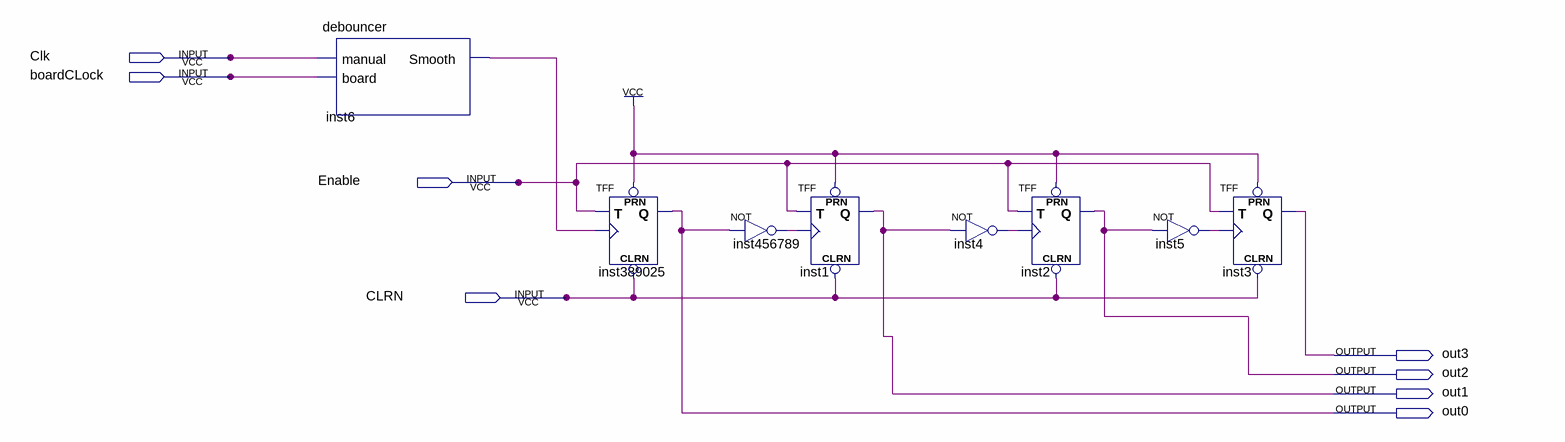
[diagram p0: schematic sheet]
// Quartus schematic upcounter.bdf as structural Verilog: 8 symbols, 8 pins
module upcounter (
  input  Clk,
  input  boardCLock,
  input  Enable,
  input  CLRN,
  output out3,
  output out2,
  output out1,
  output out0
);

  wire inst4_out, inst5_out, inst6_smooth, inst456789_out;

  debouncer inst6 (.manual(Clk), .board(boardCLock), .Smooth(inst6_smooth));
  TFF inst389025 (.PRN(1'b1), .CLRN(CLRN), .T(Enable), .CLK(inst6_smooth), .Q(out0));
  TFF inst1 (.PRN(1'b1), .CLRN(CLRN), .T(Enable), .CLK(inst456789_out), .Q(out1));
  not inst456789 (inst456789_out, out0);
  not inst4 (inst4_out, out1);
  TFF inst2 (.PRN(1'b1), .CLRN(CLRN), .T(Enable), .CLK(inst4_out), .Q(out2));
  not inst5 (inst5_out, out2);
  TFF inst3 (.PRN(1'b1), .CLRN(CLRN), .T(Enable), .CLK(inst5_out), .Q(out3));
endmodule
